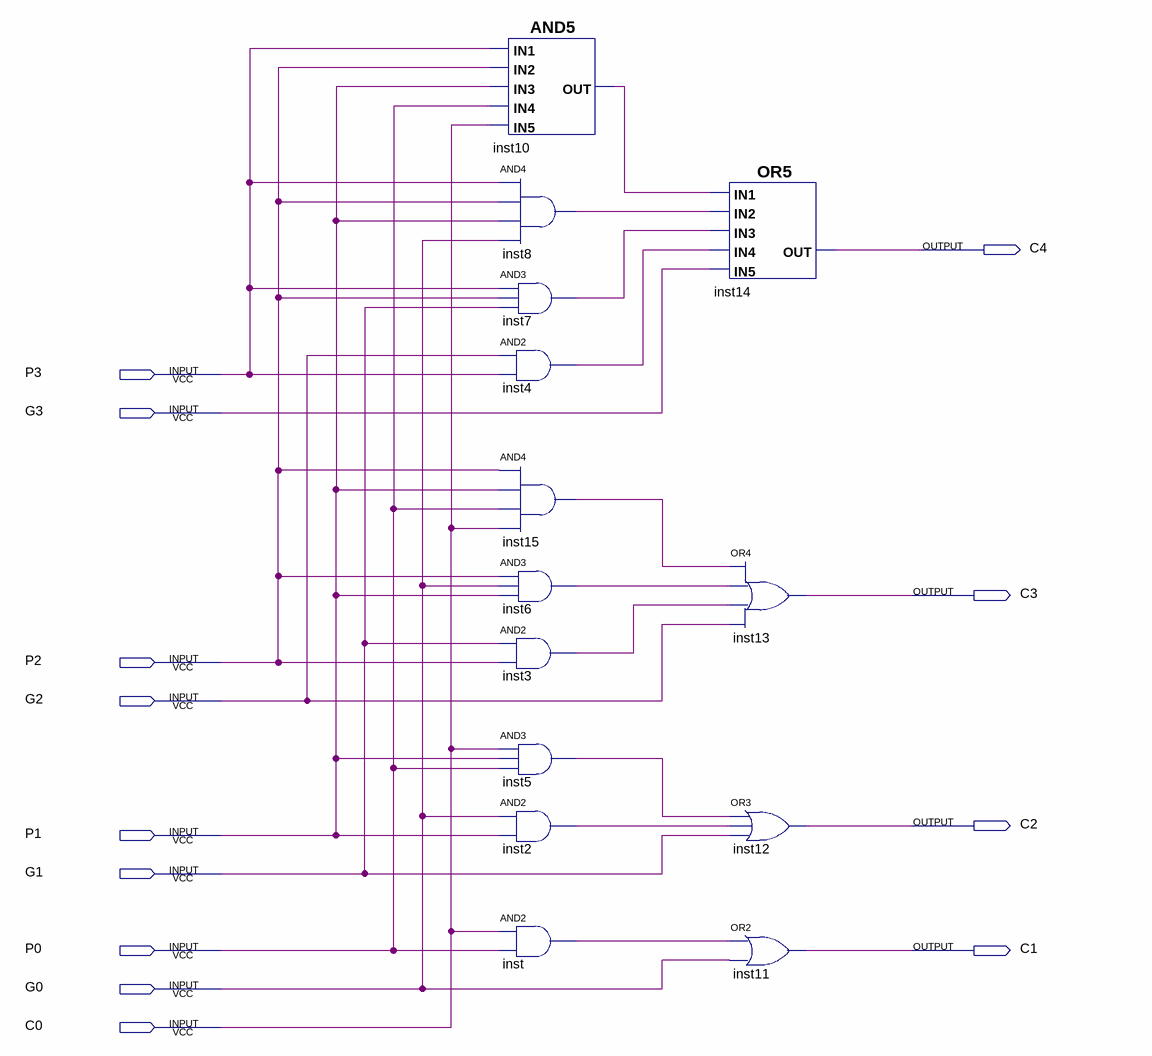
[diagram p0: schematic sheet]
// Quartus schematic LAB04_circuit.bdf as structural Verilog: 14 symbols, 13 pins
module LAB04_circuit (
  input  P3,
  input  G3,
  input  P2,
  input  G2,
  input  P1,
  input  G1,
  input  P0,
  input  G0,
  input  C0,
  output C4,
  output C3,
  output C2,
  output C1
);

  wire inst2_out, inst3_out, inst4_out, inst5_out, inst6_out, inst7_out, inst8_out, inst10_out, inst15_out,
       inst_out;

  and inst10 (inst10_out, P3, P2, P1, P0, C0);
  and inst8 (inst8_out, P3, P2, P1, G0);
  and inst7 (inst7_out, P3, P2, G1);
  and inst4 (inst4_out, G2, P3);
  and inst15 (inst15_out, P2, P1, P0, C0);
  and inst6 (inst6_out, P2, G0, P1);
  and inst3 (inst3_out, G1, P2);
  and inst5 (inst5_out, C0, P1, P0);
  and inst2 (inst2_out, G0, P1);
  and inst (inst_out, C0, P0);
  or inst14 (C4, inst10_out, inst8_out, inst7_out, inst4_out, G3);
  or inst13 (C3, inst15_out, inst6_out, inst3_out, G2);
  or inst12 (C2, inst5_out, inst2_out, G1);
  or inst11 (C1, inst_out, G0);
endmodule
